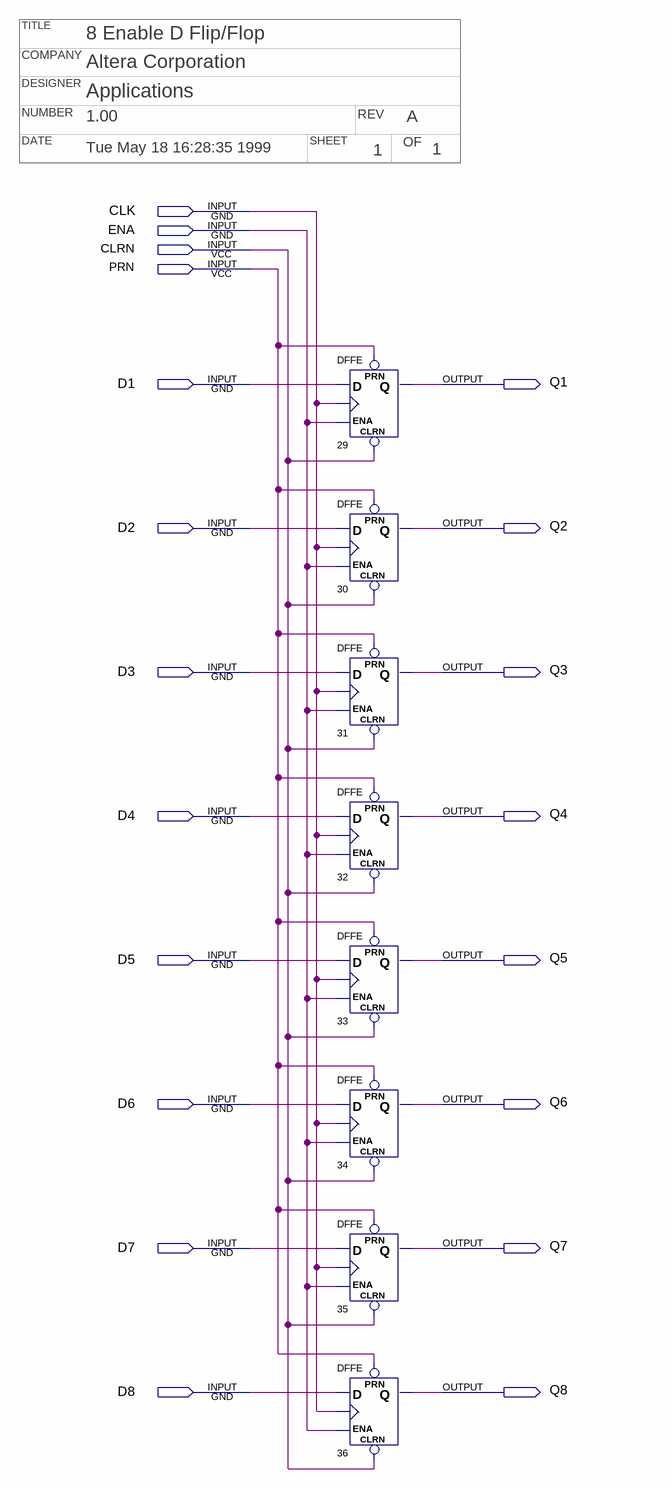
[diagram p0: schematic sheet]
// Quartus schematic 8dffe.bdf as structural Verilog: 8 symbols, 20 pins
// Title block: TITLE: 8 Enable D Flip/Flop; COMPANY: Altera Corporation; DESIGNER: Applications; NUMBER: 1.00; REV: A; DATE: Tue May 18 16:28:35 1999; SHEET: 1; OF: 1
module \8dffe  (
  input  CLK,
  input  ENA,
  input  CLRN,
  input  PRN,
  input  D1,
  input  D2,
  input  D3,
  input  D4,
  input  D5,
  input  D6,
  input  D7,
  input  D8,
  output Q1,
  output Q2,
  output Q3,
  output Q4,
  output Q5,
  output Q6,
  output Q7,
  output Q8
);

  DFFE u_29 (.PRN(PRN), .CLRN(CLRN), .D(D1), .CLK(CLK), .ENA(ENA), .Q(Q1));
  DFFE u_30 (.PRN(PRN), .CLRN(CLRN), .D(D2), .CLK(CLK), .ENA(ENA), .Q(Q2));
  DFFE u_31 (.PRN(PRN), .CLRN(CLRN), .D(D3), .CLK(CLK), .ENA(ENA), .Q(Q3));
  DFFE u_32 (.PRN(PRN), .CLRN(CLRN), .D(D4), .CLK(CLK), .ENA(ENA), .Q(Q4));
  DFFE u_33 (.PRN(PRN), .CLRN(CLRN), .D(D5), .CLK(CLK), .ENA(ENA), .Q(Q5));
  DFFE u_34 (.PRN(PRN), .CLRN(CLRN), .D(D6), .CLK(CLK), .ENA(ENA), .Q(Q6));
  DFFE u_35 (.PRN(PRN), .CLRN(CLRN), .D(D7), .CLK(CLK), .ENA(ENA), .Q(Q7));
  DFFE u_36 (.PRN(PRN), .CLRN(CLRN), .D(D8), .CLK(CLK), .ENA(ENA), .Q(Q8));
endmodule
